# Altium schematic sheet POWER.SchDoc
size 420 x 297 mm; SheetNumber: 16; SheetTotal: 19
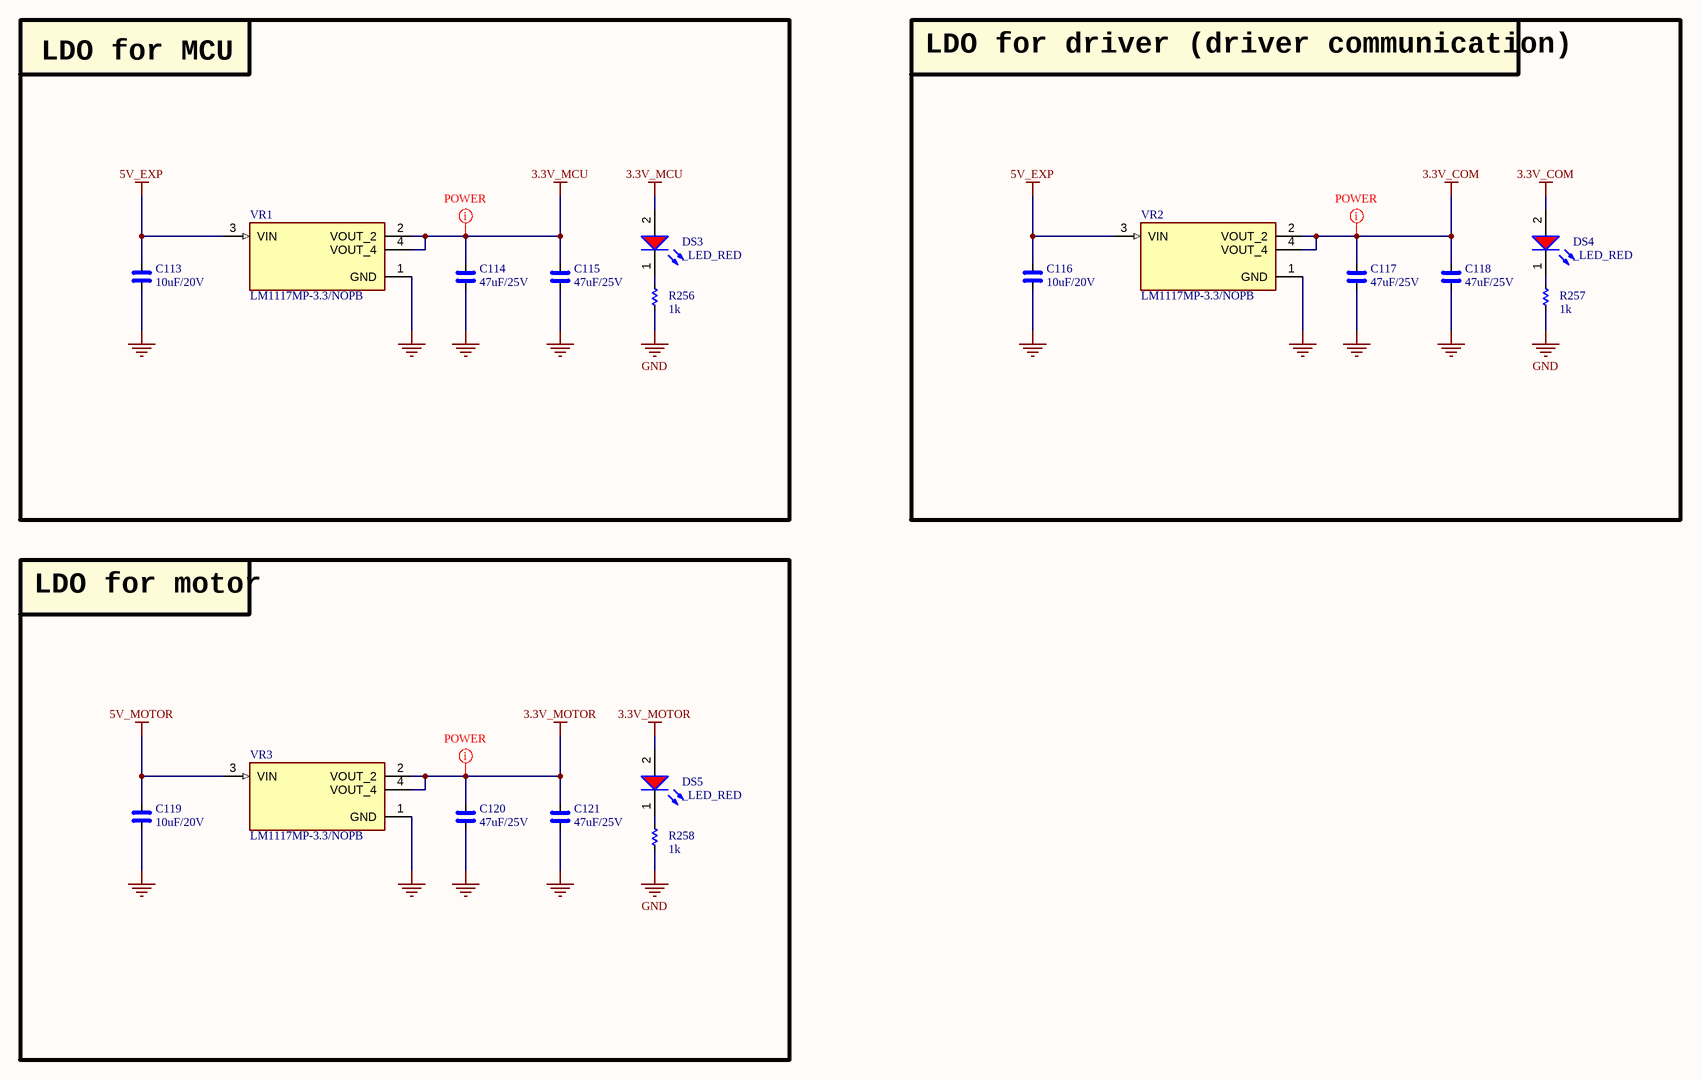
[diagram p0: POWER.SchDoc]

## Parts
C113  10uF/20V  [CAP_C_2012X110]
C114  47uF/25V  [CAP_C_3225X80]
C115  47uF/25V  [CAP_C_3225X80]
C116  10uF/20V  [CAP_C_2012X110]
C117  47uF/25V  [CAP_C_3225X80]
C118  47uF/25V  [CAP_C_3225X80]
C119  10uF/20V  [CAP_C_2012X110]
C120  47uF/25V  [CAP_C_3225X80]
C121  47uF/25V  [CAP_C_3225X80]
DS3  _LED_RED  [LED_0603]
DS4  _LED_RED  [LED_0603]
DS5  _LED_RED  [LED_0603]
R256  1k  [RES_C_1005X40]
R257  1k  [RES_C_1005X40]
R258  1k  [RES_C_1005X40]
VR1  LM1117MP-3.3/NOPB  [VREG_LM1117MP-3.3/NOPB]
VR2  LM1117MP-3.3/NOPB  [VREG_LM1117MP-3.3/NOPB]
VR3  LM1117MP-3.3/NOPB  [VREG_LM1117MP-3.3/NOPB]

## Blocks framed on the sheet
LDO for MCU: C113-C115 DS3 R256 VR1
LDO for driver (driver communication): C116-C118 DS4 R257 VR2
LDO for motor: C119-C121 DS5 R258 VR3

## Nets
3.3V_COM: C117.2 C118.2 DS4.2(A) VR2.2(VOUT_2) VR2.4(VOUT_4)
3.3V_MCU: C114.2 C115.2 DS3.2(A) VR1.2(VOUT_2) VR1.4(VOUT_4)
3.3V_MOTOR: C120.2 C121.2 DS5.2(A) VR3.2(VOUT_2) VR3.4(VOUT_4)
5V_EXP: C113.1 C116.1 VR1.3(VIN) VR2.3(VIN)
5V_MOTOR: C119.1 VR3.3(VIN)
GND: C113.2 C114.1 C115.1 C116.2 C117.1 C118.1 C119.2 C120.1 C121.1 R256.1 R257.1 R258.1 VR1.1(GND) VR2.1(GND) VR3.1(GND)
NetDS3_1: DS3.1(K) R256.2
NetDS4_1: DS4.1(K) R257.2
NetDS5_1: DS5.1(K) R258.2

## Layout directives
net class POWER: 3.3V_COM, 3.3V_MCU, 3.3V_MOTOR

## Notes on the sheet
- Project
- Sub-system:
- Design by:
- Sheet title:
- Sheet:
- of
- Checked by:
- Approved by:
- Doc no:
- Revision
- Size:
- Date:

## Library data of the parts
C113-C121 = _CAP_C_High_2: CAP High Value
R256-R258 = _RES_B_2: RES
VR1-VR3 = LM1117MP-3.3/NOPB: 800-mA 15-V linear voltage regulator; MF: Texas Instruments; SnapEDA_Link: https://www.snapeda.com/parts/LM1117MP-3.3/NOPB/Texas+Instruments/view-part/?ref=snap; Package: SOT-223-4 Texas Instruments; Value: *; MP: LM1117MP-3.3/NOPB; Check_prices: https://www.snapeda.com/parts/LM1117MP-3.3/NOPB/Texas+Instruments/view-part/?ref=eda